# EAGLE schematic levelshift (EAGLE 6.4)
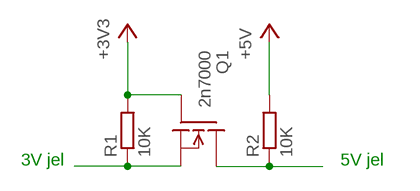
[diagram p0: schematic, sheet 1]

## Parts
Q1  2n7000  BSS97  [TO202]
R1  10K  R-EU_0309/12  [0309/12]
R2  10K  R-EU_0309/12  [0309/12]

## Nets
+3V3: Q1.3(G) R1.2
+5V: R2.2
N$1: Q1.1(S) R1.1
N$2: Q1.2(D) R2.1

## Notes on the sheet
- 3V jel | 5V jel

## Library data of the parts
Q1 = transistor-fet:BSS97: N-Channel Enhancement MOSFET 200V; 1.5A; 1,6Ohm
R1 R2 = rcl:R-EU_: RESISTOR, European symbol